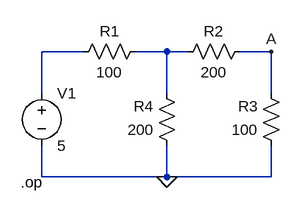
[diagram p0: schematic DC_OperatingPoint.asc]
DC_OperatingPoint.asc, the LTspice schematic file:
Version 4
SHEET 1 1008 680
WIRE 16 48 -48 48
WIRE 144 48 96 48
WIRE 176 48 144 48
WIRE 304 48 256 48
WIRE -48 112 -48 48
WIRE 144 112 144 48
WIRE 304 112 304 48
WIRE -48 240 -48 192
WIRE 144 240 144 192
WIRE 144 240 -48 240
WIRE 304 240 304 192
WIRE 304 240 144 240
FLAG 144 240 0
FLAG 304 48 A
DATAFLAG 144 48 ""
SYMBOL voltage -48 96 R0
SYMATTR InstName V1
SYMATTR Value 5
SYMBOL res 0 64 R270
WINDOW 0 32 56 VTop 2
WINDOW 3 0 56 VBottom 2
SYMATTR InstName R1
SYMATTR Value 100
SYMBOL res 272 32 R90
WINDOW 0 0 56 VBottom 2
WINDOW 3 32 56 VTop 2
SYMATTR InstName R2
SYMATTR Value 200
SYMBOL res 320 208 R180
WINDOW 0 36 76 Left 2
WINDOW 3 36 40 Left 2
SYMATTR InstName R3
SYMATTR Value 100
SYMBOL res 160 208 R180
WINDOW 0 36 76 Left 2
WINDOW 3 36 40 Left 2
SYMATTR InstName R4
SYMATTR Value 200
TEXT -80 248 Left 2 !.op

The netlist it stands for:
* DC_OperatingPoint.asc
V1 N001 0 5
R1 N001 N002 100
R2 A N002 200
R3 0 A 100
R4 0 N002 200
.op
.backanno
.end